# Altium schematic sheet Sheet1.SchDoc
size 431 x 279 mm; SheetNumber: 1; SheetTotal: 1; ENG_APP_DATE: --/--/--; DSN_APP_DATE: --/--/--; CHK_APP_DATE: --/--/--
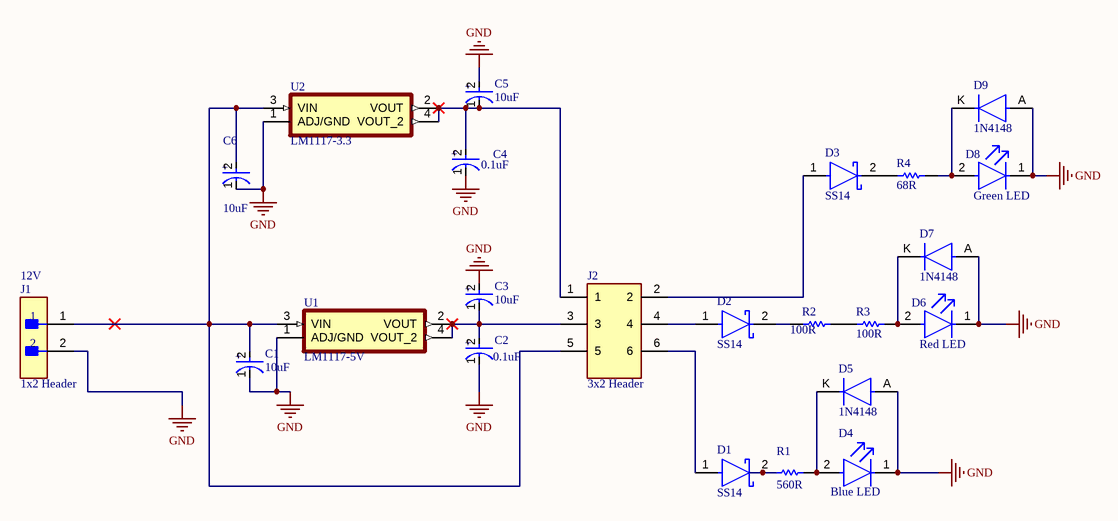
[diagram p0: Sheet1.SchDoc]

## Parts
C1  10uF  [RESC3216X125N]
C2  0.1uF  [CAPC3216X110N]
C3  10uF  [RESC3216X125N]
C4  0.1uF  [CAPC3216X110N]
C5  10uF  [RESC3216X125N]
C6  10uF  [RESC3216X125N]
D1  SS14  [DIOM5227X270N]
D2  SS14  [DIOM5227X270N]
D3  SS14  [DIOM5227X270N]
D4  Blue LED  [RESC1607X60N]
D5  1N4148  [DIOAD753W49L380D172B]
D6  Red LED  [RESC1607X60N]
D7  1N4148  [DIOAD753W49L380D172B]
D8  Green LED  [RESC1607X60N]
D9  1N4148  [DIOAD753W49L380D172B]
J1  1x2 Header  [HARWIN_M80-8420242]
J2  3x2 Header  [SHDR6W65P254_2X3_762X762X1150P]
R1  560R  [RESC1607X60N]
R2  100R  [RESC1607X60N]
R3  100R  [RESC1607X60N]
R4  68R  [RESC1607X60N]
U1  LM1117-5V  [SOT230]
U2  LM1117-3.3  [SOT230]

## Nets
GND: C1.1(C) C2.1(C) C3.2(A) C4.1(C) C5.2(A) C6.1(C) D4.1(C) D5.A D6.1(C) D7.A D8.1(C) D9.A J1.2 U1.1(ADJ/GND) U2.1(ADJ/GND)
NetC1_2: C1.2(A) C6.2(A) J1.1 J2.5 U1.3(VIN) U2.3(VIN)
NetC2_2: C2.2(A) C3.1(C) J2.3 U1.2(VOUT) U1.4(VOUT_2)
NetC4_2: C4.2(A) C5.1(C) J2.1 U2.2(VOUT) U2.4(VOUT_2)
NetD1_1: D1.1(A) J2.6
NetD1_2: D1.2(C) R1.1
NetD2_1: D2.1(A) J2.4
NetD2_2: D2.2(C) R2.1
NetD3_1: D3.1(A) J2.2
NetD3_2: D3.2(C) R4.1
NetD4_2: D4.2(A) D5.K(C) R1.2
NetD6_2: D6.2(A) D7.K(C) R3.2
NetD8_2: D8.2(A) D9.K(C) R4.2
NetR2_2: R2.2 R3.1

## Notes on the sheet
- (near J1) 12V
- DWG. NO.
- REV.
- SHT.
- THIS DOCUMENT AND THE DATA DISCLOSED HEREIN OR HEREWITH IS THE PROPERTY OF ALTIUM LIMITED AND MAY BE FREELY DISTRIBUTED IN WHOLE. NO RIGHTS ARE RESERVED OR EXPRESS OR IMPLIED WARANTEE GIVEN.
- REVISION
- DESCRIPTION
- DATE
- APPROVED
- ENG:
- APPROVALS
- PROJECT
- DSN:
- CHK:
- REFERENCE DOCUMENTS
- PROJECT REVISION:
- TITLE
- DOCUMENT REVISION:
- DESIGN ITEM:
- BOM:
- FAB DWG:
- PCB DWG:
- ASSY DWG:
- SCALE:
- SIZE
- B
- CAGE CODE
- FILE NAME
- DWG NO.
- SHEET
- OF
- REV
- (in symbol T491A104K035AT) +
- (in symbol T491B106K016AT) +

## Library data of the parts
C1 C3 C5 C6 = T491B106K016AT: CAP TANT 10UF 10% 16V 1411; Dissipation Factor: 6%; ESR (Equivalent Series Resistance): 2.8R; Ripple Current: 174mA; Dielectric Material: Tantalum; Leakage Current: 1.6uA; Polarity: Polar; Life (Hours): 2000Hour; Case/Package: 1411; Height - Seated (Max): 0.083inch; Case Code (Metric): 3528; Height: 1.9mm; Packaging: Tape and Reel; RoHS Compliant: Yes; Voltage Rating (DC): 16V; Tolerance: 10%; Lead Pitch: 1.9mm; Min Operating Temperature: -55°C; Package Quantity: 1; Capacitance: 10uF; Mount: Surface Mount; Length: 3.5mm; Max Operating Temperature: 125°C; Number of Pins: 2; Voltage: 16V; Voltage Rating: 16V; Termination: SMD/SMT; Depth: 2.8mm; Lead Free: Lead Free; REACH SVHC: No SVHC; Case Code (Imperial): 1411; Width: 0.11inch; Features: General Purpose
C2 C4 = T491A104K035AT: CAP TANT 0.1UF 10% 35V 1206; Dissipation Factor: 4%; ESR (Equivalent Series Resistance): 20R; Polarity: Polar; Dielectric Material: Tantalum; Leakage Current: 500nA; Ripple Current: 61mA; Life (Hours): 2000Hour; Capacitance: 100nF; Width: 1.6mm; Radiation Hardening: No; Lead Free: Lead Free; Case Code (Metric): 3216; REACH SVHC: No SVHC; Termination: SMD/SMT; Tolerance: 10%; Height - Seated (Max): 0.071inch; Series: T491; Features: General Purpose; Lead Pitch: 1.2mm; RoHS Compliant: Yes; Number of Pins: 2; Voltage: 35V; Packaging: Tape and Reel; Depth: 1.6mm; Length: 3.2mm; Case Code (Imperial): 1206; Construction: Flat; Min Operating Temperature: -55°C; Max Operating Temperature: 125°C; Height: 1.6mm; Voltage Rating: 35V; Case/Package: 1206; Package Quantity: 1; Weight: 0.000571oz; Size: 1.6mm; Voltage Rating (DC): 35V; Mount: Surface Mount
D1-D3 = SS14: DIODE SCHOTTKY 40V 1A SMA; Manufacturer: ON Semiconductor; Peak Reverse Current: 0.2mA; Max Junction Temp: +125°C; Standoff Height: 0.05mm; Max Surge Forward Current: 40A; Mouser Description: Schottky Diodes & Rectifiers SMA 40V 1.0A; RoHS: TRUE; Lead Free: Yes; Manufacturer Part Number: SS14; Device Class L3: Schottky Diodes; Category: Diode; Automotive: No; Digikey Description: DIODE SCHOTTKY 40V 1A SMA; ComponentLink2Description: Datasheet; Device Class L2: Diodes; Height: 2.5mm; Temperature Range High: +125°C; ComponentLink2URL: https://www.onsemi.com/pub/Collateral/SS19-D.PDF; Device Class L1: Discrete Semiconductors; Package: 403AE; Octopart: https://octopart.com/ss14-on+semiconductor-29205033; Max Repetitive Reverse Voltage: 40V; Temperature Range Low: -65°C; Forward Current: 1A; Temperature: -65°C to +125°C
D4 D8 = LTT-C190KBKT: LED BLUE CLEAR CHIP SMD; Color: Red; Reverse Voltage: 5V; Viewing Angle: 130°; Power Rating: 75mW; Test Current: 20mA; Number of Elements: 1; Lens Color: Colorless; Wavelength: 639nm; Dominant Wavelength: 631nm; Lens Style: Diffused; Forward Current: 30mA; Forward Voltage: 2.4V; Luminous Intensity: 54mcd; Case Code (Imperial): 0603; Lens Transparency: Clear; Lead Free: Lead Free; Package Quantity: 1; Packaging: Tape and Reel; Max Operating Temperature: 85°C; Number of Pins: 2; Height: 0.8mm; Case/Package: 0603; Number of LEDs: 1; Width: 0.8mm; Case Code (Metric): 1608; Depth: 0.8mm; Mount: Surface Mount; Radiation Hardening: No; Length: 1.6mm; Illumination Color: Red; Power Dissipation: 75mW; Min Operating Temperature: -55°C
D5 D7 D9 = 1N4148: DIODE GEN PURP 100V 200MA DO35; Forward Voltage: 1V; Max Power Dissipation: 500mW; Max Reverse Current: 5uA; Forward Current: 300mA; Current: 4A; Reverse Recovery Time: 4ns; Element Configuration: Single; Outside Diameter: 1.85mm; Capacitance: 4pF; Polarity: Standard; Max Forward Surge Current (Ifsm): 1A; Reverse Voltage: 100V; Output Current: 200mA; Average Rectified Current: 200mA; Diameter: 1.91mm; Max Repetitive Reverse Voltage (Vrrm): 100V; Current Rating: 200mA; Case/Package: DO-35; Lead Free: Lead Free; Number of Pins: 2; Recovery Time: 4ns; Packaging: Bulk; Contact Plating: Tin; Voltage: 100V; Mount: Through Hole; Max Surge Current: 4A; Package Quantity: 2000; Width: 1.91mm; Max Reverse Voltage (DC): 100V; Length: 4.56mm; Radiation Hardening: No; Power Dissipation: 500mW; Voltage Rating (DC): 100V; Peak Non-Repetitive Surge Current: 4A; REACH SVHC: No SVHC; Height: 4.56mm; Max Operating Temperature: 175°C; Series: -; Weight: 0.01lb; Min Operating Temperature: -65°C
D6 = LTT-C190KBKT: LED BLUE CLEAR CHIP SMD; Reverse Voltage: 5V; Viewing Angle: 130°; Power Rating: 75mW; Test Current: 20mA; Number of Elements: 1; Lens Color: Colorless; Wavelength: 639nm; Dominant Wavelength: 631nm; Lens Style: Diffused; Forward Current: 30mA; Forward Voltage: 2.4V; Luminous Intensity: 54mcd; Color: Red; Case Code (Imperial): 0603; Lens Transparency: Clear; Lead Free: Lead Free; Package Quantity: 1; Packaging: Tape and Reel; Max Operating Temperature: 85°C; Number of Pins: 2; Height: 0.8mm; Case/Package: 0603; Number of LEDs: 1; Width: 0.8mm; Case Code (Metric): 1608; Depth: 0.8mm; Mount: Surface Mount; Radiation Hardening: No; Length: 1.6mm; Illumination Color: Red; Power Dissipation: 75mW; Min Operating Temperature: -55°C
J1 = 3bc925449376181038e59eaffc5286c: CONN HEADER R/A 2POS 2MM; Max Current Rating: 3A; Number of Contacts: 2; Voltage Rating: 120V; Gender: Male; Contact Resistance: 25mR; Insulation Resistance: 100MR; Connector Type: Plug; Contact Material: Bronze; Radiation Hardening: No; Pitch: 2mm; Contact Plating: Gold; Package Quantity: 32; Current Rating: 3A; REACH SVHC: No SVHC; Housing Material: Polyamide; Max Operating Temperature: 125°C; Min Operating Temperature: -55°C; Number of Rows: 1; RoHS Compliant: Yes; Housing Color: Black; Fastening Type: Latch; Color: Black; Contact Gender: Male; Orientation: Right Angle; Number of Positions: 2; Case/Package: SIL; Length: 7.6mm; Max Voltage Rating (AC): 120V; Series: Datamate L-Tek; Packaging: Rail/Tube; Contact Type: Male Pin; Mount: Through Hole; Termination: Solder
J2 = 281739-3: 3X2 connector; Source: 281739-3.SchLib; MP: 281739-3; Pin Count: 6; Availability: Unavailable; Value: *; Package: None; Component Type: Standard; Price: None; Design Item ID: 281739-3
R1 = RES 430 Ohm: 560 Ohm SMD 0603 Resistor; Manufacturer: Panasonic; Part Number: ERJ-3GEYJ431V
R2 = RES 20  Ohm: 100 ohm resistor SMD 0603; Part Number: RC0603FR-1020RL; Manufacturer: YAGEO
R3 = RES  48 Ohms: Resistor 100 Ohms SMD 0603; Part Number: ERJ-L03UJ48MV; Manufacturer: Panasonic
R4 = RES 150 Ohm_1: 68 ohm resistor SMD 0603; Part Number: ERA3AEB151V; Manufacturer: Panasonic
U1 U2 = LM1117-3.3_1: SOT-223 LM1117-3.3; MF: Texas Instruments; Source: SnapEDAsch.SchLib; Availability: Unavailable; SnapEDA_Link: https://www.snapeda.com/parts/LM1117-3.3/Texas%20Instruments/view-part/549181/?ref=snap; Pin Count: 4; Design Item ID: LM1117-3.3; Value: *; Component Type: Standard; Package: SOT-223-4 Texas Instruments; Price: None; MP: LM1117-3.3